# Altium project CONTROLBAORD.PrjPcb
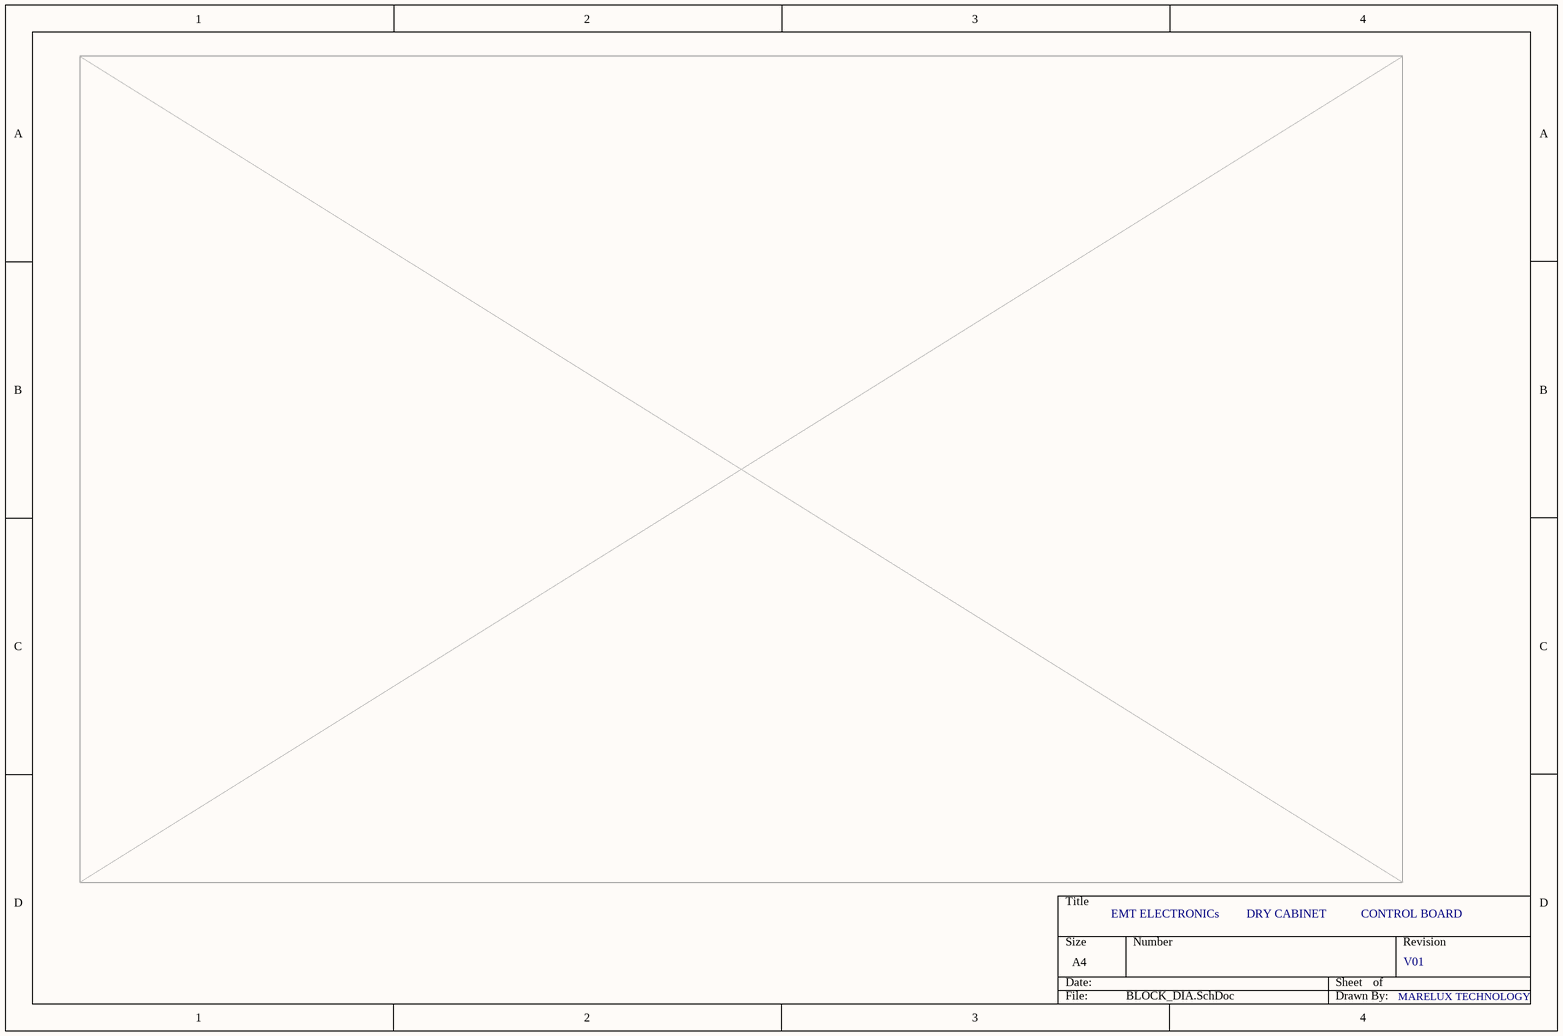
[diagram p0: BLOCK_DIA.SchDoc]
CUSTOMER: EMT ELECTRONICs; DATE(MONTH): JULY; DESIGNER: MARELUX TECHNOLOGY; HARDWARE: CONTROL BOARD; PROJECT: DRY CABINET; VERSION: V01
7 sheets, 152 parts. Net scope: flat (ports and power ports of the same name join across sheets).
Board file: CONTROLBAORD_PCB.PcbDoc
Sheets:
  BLOCK_DIA.SchDoc
  POWER.SchDoc
  MICROCONTROLLER.SchDoc
  UART_USB.SchDoc
  MISC.SchDoc
  ALARM_POWER.SchDoc
  CONNECTORs.SchDoc

## Sheet BLOCK_DIA.SchDoc
size A4

## Sheet POWER.SchDoc
size A4
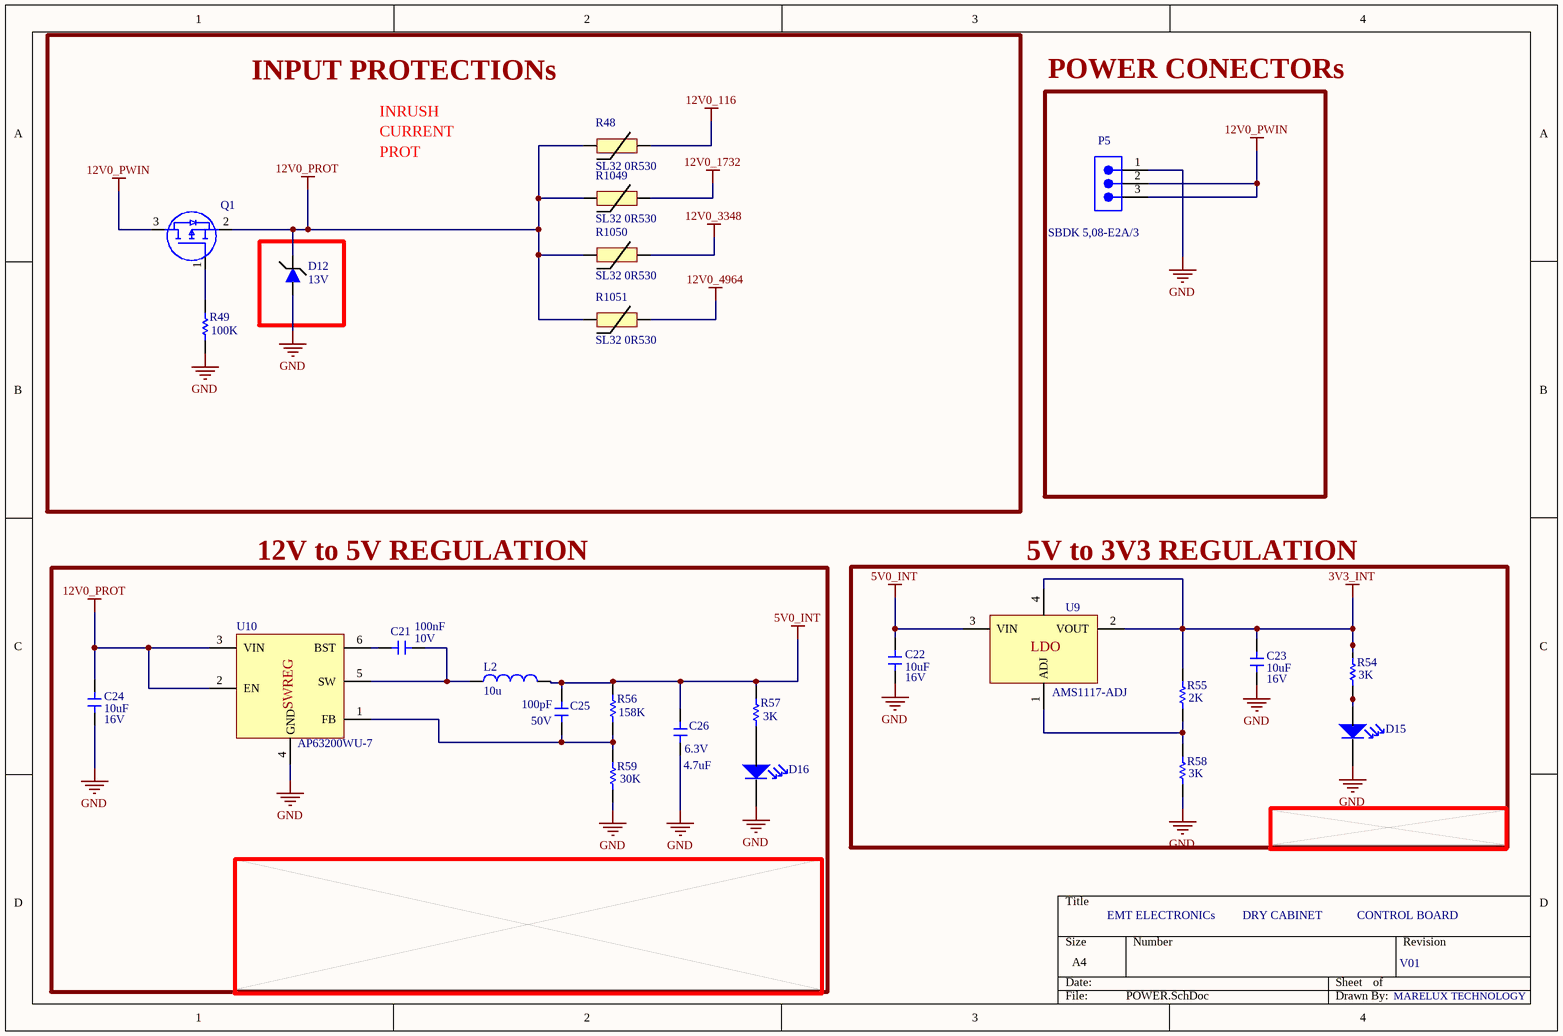
[diagram p1: POWER.SchDoc]

### Parts
C21  value 100nF  Voltage: 10V  [CAP_0402_CER]  (hidden comment: CL05B104KP5NNNC)
C22  value 10uF  Voltage: 16V  [CAP_0805_CER]  (hidden comment: CL21A106KOQNNNE)
C23  value 10uF  Voltage: 16V  [CAP_0805_CER]  (hidden comment: CL21A106KOQNNNE)
C24  value 10uF  Voltage: 16V  [CAP_0805_CER]  (hidden comment: CL21A106KOQNNNE)
C25  value 100pF  Voltage: 50V  [CAP_0402_CER]  (hidden comment: CC0402JRNPO9BN101)
C26  value 4.7uF  Voltage: 6.3V  [CAP_0402_CER]  (hidden comment: CL10A475KP8NNNC)
D12  value 13V  [SOD-123F]  (hidden comment: SMF13A)
D15  HSMM-C170  [LED_0805_SMD]  (value not drawn)
D16  HSMM-C170  [LED_0805_SMD]  (value not drawn)
L2  value 10u  [IND_YAGEO]  (hidden comment: BMRB00060630100MA1)
P5  SBDK 5,08-E2A/3  [691311500003]
Q1  SQM110P06-8M9L_GE3  [SQM110P06_MOSFET]  (value not drawn)
R48  SL32 0R530  [SL32 0R530]
R49  value 100K  [RES_0402_SMD]  (hidden comment: RMCF0402JT100K)
R54  value 3K  [RES_0402_SMD]  (hidden comment: RMCF0402FT3K00)
R55  value 2K  [RES_0402_SMD]  (hidden comment: RMCF0402FT2K00)
R56  value 158K  [RES_0402_SMD]  (hidden comment: RMCF0402FT158K)
R57  value 3K  [RES_0402_SMD]  (hidden comment: RMCF0402FT3K00)
R58  value 3K  [RES_0402_SMD]  (hidden comment: RMCF0402FT3K00)
R59  value 30K  [RES_0402_SMD]  (hidden comment: *)
R1049  SL32 0R530  [SL32 0R530]
R1050  SL32 0R530  [SL32 0R530]
R1051  SL32 0R530  [SL32 0R530]
U9  AMS1117-ADJ  [SOT-223-3]
U10  AP63200WU-7  [TSOT-23-6]

### Blocks framed on the sheet
INPUT PROTECTIONs: D12 Q1 R48 R49 R1049-R1051
POWER CONECTORs: P5
12V to 5V REGULATION: C21 C24-C26 D16 L2 R56 R57 R59 U10
5V to 3V3 REGULATION: C22 C23 D15 R54 R55 R58 U9

### Nets
3V3_INT: C23.2 R54.2 R55.2 U9.2(VOUT) U9.4(OUT)
5V0_INT: C22.2 C25.2 C26.2 L2.2 R56.2 R57.2 U9.3(VIN)
12V0_116: R48.2
12V0_1732: R1049.2
12V0_3348: R1050.2
12V0_4964: R1051.2
12V0_PROT: C24.2 D12.1(C) Q1.2(S) R48.1 R1049.1 R1050.1 R1051.1 U10.2(EN) U10.3(VIN)
12V0_PWIN: P5.2 P5.3 Q1.3(D)
GND: C22.1 C23.1 C24.1 C26.1 D12.2(A) D15.C D16.C P5.1 R49.1 R58.1 R59.1 U10.4(GND)
NetC21_1: C21.1 U10.6(BST)
NetC21_2: C21.2 L2.1 U10.5(SW)
NetC25_1: C25.1 R56.1 R59.2 U10.1(FB)
NetD15_A: D15.A R54.1
NetD16_A: D16.A R57.1
NetQ1_1: Q1.1(G) R49.2
NetR55_1: R55.1 R58.2 U9.1(ADJ)

### Notes on the sheet
- INRUSH
- CURRENT
- PROT
- (in symbol AMS1117-ADJ) LDO
- (in symbol AP63200WU-7) SWREG

### Library data of the parts
C21 C25 C26 = CAP_GEN_CER: Generic; Place: P; Power: *; Package: 0402; Tolerance: *; Operating Temp.: *
  C21: Part Number: CL05B104KP5NNNC
  C25: Part Number: CC0402JRNPO9BN101
  C26: Part Number: CL10A475KP8NNNC
C22-C24 = CAP_GEN_CER: 10uF 0805 Ceramic Capacitor; Place: P; Part Number: CL21A106KOQNNNE; Power: *; Package: *; Tolerance: *; Operating Temp.: *
D12 = SMF13A: TVS DIODE 200W 14.4V-15.9V SOD-123; Manufacturer: ANBON SEMI; Voltage: 14.4V; Place: P; Part Number: SMF13A; Power: 200W; Tolerance: N/A; Package: SOD-123F; Operating Temp.: -55°C ~ 150°C
D15 = LED_GEN: Manufacturer: Broadcom; Voltage: 3.3V; Place: P; Part Number: HSMM-C170; Value: *; Power: *; Tolerance: *; Package: 0805; Operating Temp.: *
D16 = LED_GEN: Manufacturer: Broadcom; Voltage: 3.3V; Place: POP; Part Number: HSMM-C170; Value: *; Power: *; Tolerance: *; Package: 0805; Operating Temp.: *
L2 = BMRB00060630100MA1: FIXED IND 10UH 4A 68 MOHM SMD; Manufacturer: PULSE; Place: POP; Current: 4; Tolerance: ±20%; Part Number: BMRB00060630100MA1; Power: N/A; Package: IND_YAGEO; Operating Temp.: -55°C ~ 125°C
P5 = 691311500003: WR-TBL Series 311 Open Vertical PCB Header, THT, pitch 5.08mm, 03p; Manufacturer: Wurth Elektronik; Modularity: No; Rated Current: 20A; System: Pluggable Connector; Working Voltage: 300V; Manufacturer Part Number: SBDK 5,08-E2A/3; Category: Terminal Block; Match Code: WR-TBL; ComponentLink1Description: Website Link; ComponentLink1URL: https://www.we-online.com/redexpert/article/691311500003?ad; ComponentLink2Description: Datasheet Link; ComponentLink2URL: https://www.we-online.com/redexpert/spec/691311500003?ad; Mount: Through Hole; Min Operating Temperature: -40°C; Max Operating Temperature: 105°C; Packaging: Box; Application: Pluggable; Number of Pins: 3; Number of Rows: 1; Orientation: Vertical; Pitch: 5.08mm
Q1 = SQM110P06-8M9L_GE3: P-Channel 60 V 110A (Tc) 230W (Tc) Surface Mount TO-263 (D2PAK); Voltage: 20 V; Place: POP; Part Number: SQM110P06-8M9L_GE3; Value: N/A; Power: 110A; Tolerance: N/A; Package: SQM110P06-8M9L_GE3; Operating Temp.: -55°C ~ 150°C
R48 R1049-R1051 = SL32 0R530: Inrush Current Limiter 500 mOhms ±20% 30 A 1.220" (31.00mm); Manufacturer: Cantherm; Value: 30A; Tolerance: 20; Place: POP; Part Number: SL32 0R530; Voltage: N/A; Power: N/A; Package: SL32 0R530; Operating Temp.: -65°C ~ 150°C
R49 R54-R59 = RES_GEN_SMD: Generic Chip Res; Place: P; Power: *; Tolerance: *; Voltage: *; Operating Temp.: *
  R49: Package: *; Part Number: RMCF0402JT100K
  R54 R57 R58: Package: *; Part Number: RMCF0402FT3K00
  R55: Package: *; Part Number: RMCF0402FT2K00
  R56: Package: *; Part Number: RMCF0402FT158K
  R59: Package: RMCF0402JT30K0; Part Number: *
U9 = AMS1117-ADJ: IC LDO REG ADJ 1A SOT223; Manufacturer: EVVO; Place: P; Part Number: AMS1117-ADJ; Value: 1A; Voltage: ADJ; Power: N/A; Tolerance: N/A; Package: SOT-223-3; Operating Temp.: -40°C ~ 85°C
U10 = AP63200WU-7: IC REG BUCK ADJ 2A TSOT23-6 / 3.8V to 32V; Manufacturer: Diodes Incorporated; Operatin Temp.: -40°C ~ 85; Place: POP; Part Number: AP63200WU-7; Value: N/A; Voltage: ADJ; Power: N/A; Tolerance: N/A; Package: TSOT-23-6

## Sheet MICROCONTROLLER.SchDoc
size A4 portrait
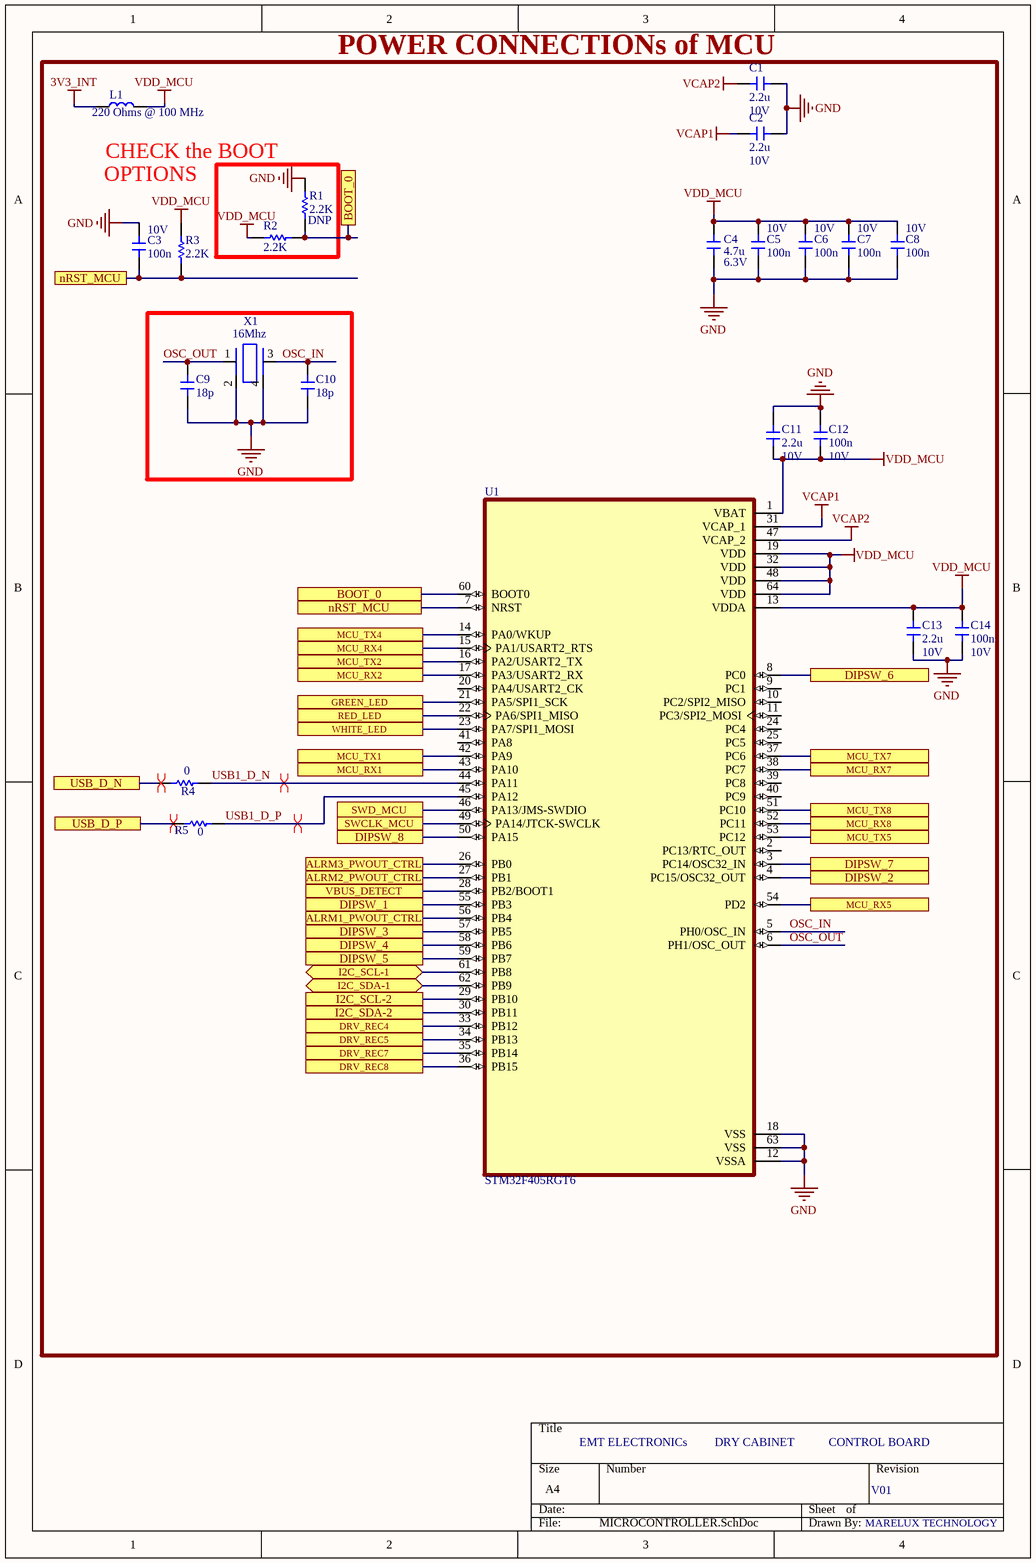
[diagram p2: MICROCONTROLLER.SchDoc]

### Parts
C1  value 2.2u  Voltage: 10V  [CAP_0603_CER]  (hidden comment: CL10A225KP8NNNC)
C2  value 2.2u  Voltage: 10V  [CAP_0603_CER]  (hidden comment: CL10A225KP8NNNC)
C3  value 100n  Voltage: 10V  [CAP_0402_CER]  (hidden comment: CL05B104KP5NNNC)
C4  value 4.7u  Voltage: 6.3V  [CAP_0603_CER]  (hidden comment: CL10A475KP8NNNC)
C5  value 100n  Voltage: 10V  [CAP_0402_CER]  (hidden comment: CL05B104KP5NNNC)
C6  value 100n  Voltage: 10V  [CAP_0402_CER]  (hidden comment: CL05B104KP5NNNC)
C7  value 100n  Voltage: 10V  [CAP_0402_CER]  (hidden comment: CL05B104KP5NNNC)
C8  value 100n  Voltage: 10V  [CAP_0402_CER]  (hidden comment: CL05B104KP5NNNC)
C9  value 18p  [CAP_0402_CER]  (hidden comment: CC0402JRNPO9BN180)
C10  value 18p  [CAP_0402_CER]  (hidden comment: CC0402JRNPO9BN180)
C11  value 2.2u  Voltage: 10V  [CAP_0603_CER]  (hidden comment: CL10A225KP8NNNC)
C12  value 100n  Voltage: 10V  [CAP_0402_CER]  (hidden comment: CL05B104KP5NNNC)
C13  value 2.2u  Voltage: 10V  [CAP_0603_CER]  (hidden comment: CL10A225KP8NNNC)
C14  value 100n  Voltage: 10V  [CAP_0402_CER]  (hidden comment: CL05B104KP5NNNC)
L1  value 220 Ohms @ 100 MHz  [IND_0603_SMD]  (hidden comment: MPZ1608S221ATA00)
R1  value 2.2K  Place: DNP  [RES_0402_SMD]  (hidden comment: RMCF0402JT2K20)
R2  value 2.2K  [RES_0402_SMD]  (hidden comment: RMCF0402JT2K20)
R3  value 2.2K  [RES_0402_SMD]  (hidden comment: RMCF0402JT2K20)
R4  value 0  [RES_0402_SMD]  (hidden comment: RC0402JR-070RL)
R5  value 0  [RES_0402_SMD]  (hidden comment: RC0402JR-070RL)
U1  STM32F405RGT6  [LQFP64-10x10mm]
X1  value 16Mhz  [XTAL-4SMD]  (hidden comment: CF4016M00009T1521005)

### Ports
ALRM1_PWOUT_CTRL, ALRM2_PWOUT_CTRL, ALRM3_PWOUT_CTRL, BOOT_0, DIPSW_1, DIPSW_2, DIPSW_3, DIPSW_4, DIPSW_5, DIPSW_6, DIPSW_7, DIPSW_8, DRV_REC4, DRV_REC5, DRV_REC7, DRV_REC8, GREEN_LED, I2C_SCL-1 (bidir), I2C_SCL-2, I2C_SDA-1 (bidir), I2C_SDA-2, MCU_RX1, MCU_RX2, MCU_RX4, MCU_RX5, MCU_RX7, MCU_RX8, MCU_TX1, MCU_TX2, MCU_TX4, MCU_TX5, MCU_TX7, MCU_TX8, nRST_MCU, RED_LED, SWCLK_MCU, SWD_MCU, USB_D_N, USB_D_P, VBUS_DETECT, WHITE_LED

### Nets
3V3_INT: L1.1
GND: C1.1 C2.1 C3.1 C4.1 C5.2 C6.2 C7.2 C8.2 C9.2 C10.2 C11.2 C12.1 C13.1 C14.2 R1.2 U1.12(VSSA) U1.18(VSS) U1.63(VSS) X1.2 X1.4
VCAP1: C2.2 U1.31(VCAP_1)
VCAP2: C1.2 U1.47(VCAP_2)
VDD_MCU: C4.2 C5.1 C6.1 C7.1 C8.1 C11.1 C12.2 C13.2 C14.1 L1.2 R2.2 R3.1 U1.1(VBAT) U1.13(VDDA) U1.19(VDD) U1.32(VDD) U1.48(VDD) U1.64(VDD)
I2C_SCL-1: U1.61(PB8) ; port I2C_SCL-1
I2C_SDA-1: U1.62(PB9) ; port I2C_SDA-1
OSC_IN: C10.1 U1.5(PH0/OSC_IN) X1.3
OSC_OUT: C9.1 U1.6(PH1/OSC_OUT) X1.1
USB1_D_N: R4.2 U1.44(PA11)
USB1_D_P: R5.2 U1.45(PA12)
USB_D_N: R4.1 ; port USB_D_N
USB_D_P: R5.1 ; port USB_D_P
NetC3_2: C3.2 R3.2 U1.7(NRST) ; port nRST_MCU
NetEXTRA1_1: U1.29(PB10) ; port I2C_SCL-2
NetEXTRA1_2: U1.30(PB11) ; port I2C_SDA-2
NetEXTRA1_4: U1.17(PA3/USART2_RX) ; port MCU_RX2
NetEXTRA1_5: U1.16(PA2/USART2_TX) ; port MCU_TX2
NetPROG1_2: U1.49(PA14/JTCK-SWCLK) ; port SWCLK_MCU
NetPROG1_3: U1.46(PA13/JMS-SWDIO) ; port SWD_MCU
NetQ6_1: U1.56(PB4) ; port ALRM1_PWOUT_CTRL
NetQ2001_1: U1.27(PB1) ; port ALRM2_PWOUT_CTRL
NetQ2004_1: U1.26(PB0) ; port ALRM3_PWOUT_CTRL
NetR1_1: R1.1 R2.1 U1.60(BOOT0) ; port BOOT_0
NetR8_1: U1.50(PA15) ; port DIPSW_8
NetR9_1: U1.3(PC14/OSC32_IN) ; port DIPSW_7
NetR10_1: U1.8(PC0) ; port DIPSW_6
NetR11_1: U1.59(PB7) ; port DIPSW_5
NetR12_1: U1.58(PB6) ; port DIPSW_4
NetR13_1: U1.57(PB5) ; port DIPSW_3
NetR14_1: U1.4(PC15/OSC32_OUT) ; port DIPSW_2
NetR15_1: U1.55(PB3) ; port DIPSW_1
NetR23_2: U1.15(PA1/USART2_RTS) ; port MCU_RX4
NetR24_2: U1.54(PD2) ; port MCU_RX5
NetR27_2: U1.14(PA0/WKUP) ; port MCU_TX4
NetR28_2: U1.53(PC12) ; port MCU_TX5
NetR31_2: U1.33(PB12) ; port DRV_REC4
NetR32_2: U1.34(PB13) ; port DRV_REC5
NetR33_2: U1.22(PA6/SPI1_MISO) ; port RED_LED
NetR36_2: U1.38(PC7) ; port MCU_RX7
NetR37_2: U1.52(PC11) ; port MCU_RX8
NetR38_2: U1.23(PA7/SPI1_MOSI) ; port WHITE_LED
NetR41_2: U1.37(PC6) ; port MCU_TX7
NetR42_2: U1.51(PC10) ; port MCU_TX8
NetR45_2: U1.35(PB14) ; port DRV_REC7
NetR46_2: U1.36(PB15) ; port DRV_REC8
NetR47_2: U1.21(PA5/SPI1_SCK) ; port GREEN_LED
NetR61_2: U1.28(PB2/BOOT1) ; port VBUS_DETECT
NetU1_42: U1.42(PA9) ; port MCU_TX1
NetU1_43: U1.43(PA10) ; port MCU_RX1

Not connected (* = marked no-connect by the designer): U1 2(PC13/RTC_OUT) 9(PC1) 10(PC2/SPI2_MISO) 11(PC3/SPI2_MOSI) 20(PA4/USART2_CK) 24(PC4) 25(PC5) 39(PC8) 40(PC9) 41(PA8)

### Layout directives
differential pair: USB1_D_N, USB1_D_P, USB_D_N, USB_D_P

### Notes on the sheet
- POWER CONNECTIONs of MCU
- CHECK the BOOT
- OPTIONS

### Library data of the parts
C1-C14 = CAP_GEN_CER: Generic; Place: P; Power: *; Tolerance: *; Operating Temp.: *
  C1 C2 C11 C13: Part Number: CL10A225KP8NNNC; Package: *
  C3 C5-C8 C12 C14: Part Number: CL05B104KP5NNNC; Package: *
  C4: Part Number: CL10A475KP8NNNC; Package: *
  C9 C10: Part Number: CC0402JRNPO9BN180; Package: 0402; Voltage: *
L1 = IND_GEN_SMD: Generic SMD IND/BEAD; Place: P; Part Number: MPZ1608S221ATA00; Power: *; Package: *; Tolerance: *; Voltage: *; Operating Temp.: *
R1 = RES_GEN_SMD: Generic Chip Res; Package: *; Part Number: RMCF0402JT2K20; Power: *; Tolerance: *; Voltage: *; Operating Temp.: *
R2-R5 = RES_GEN_SMD: Generic Chip Res; Place: P; Package: *; Power: *; Tolerance: *; Voltage: *; Operating Temp.: *
  R2 R3: Part Number: RMCF0402JT2K20
  R4 R5: Part Number: RC0402JR-070RL
U1 = STM32F405RGT6: High-performance foundation line, ARM Cortex-M4 core with DSP and FPU, 1 Mbyte Flash, 168 MHz CPU, ART Accelerator; Value: *; Package: None; MP: STM32F405RGT6; Price: None; Availability: Unavailable
X1 = XTAL-4PINs: 16 MHz ±10ppm Crystal 9pF 40 Ohms 4-SMD, No Lead; Manufacturer: Hefei Jingweite Electronics Co., Ltd.; Place: POP; Voltage: N/A; Tolerance: ±10ppm; Power: N/A; Part Number: CF4016M00009T1521005; Operating Temp.: -40°C ~ 125°C

## Sheet UART_USB.SchDoc
size A4
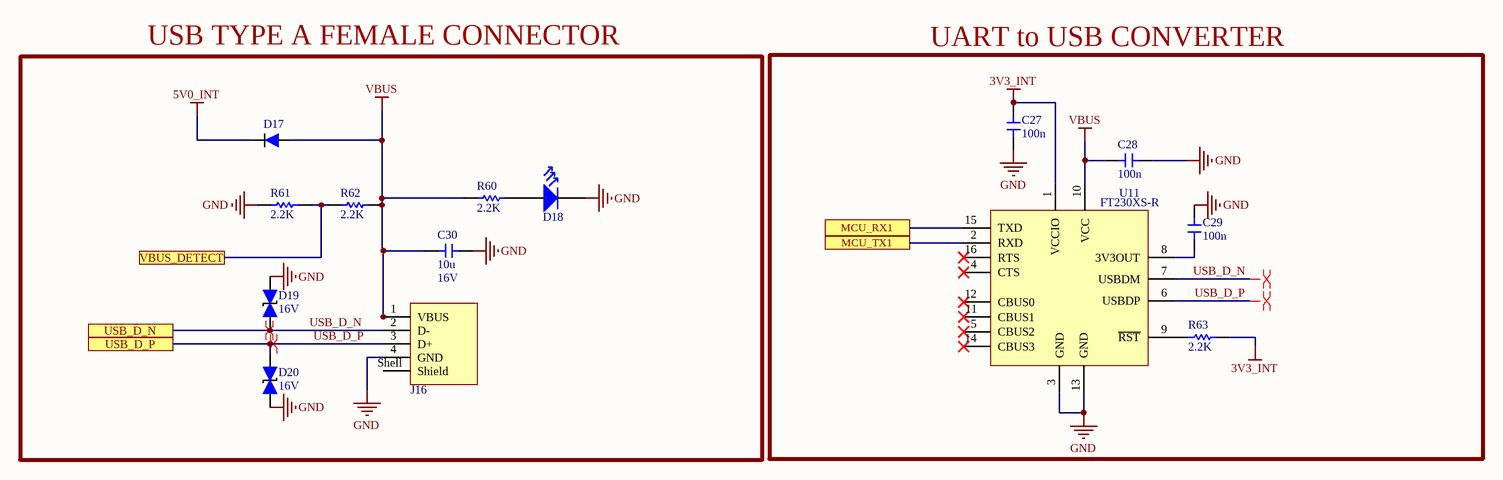
[diagram p3: UART_USB.SchDoc]

### Parts
C27  value 100n  [CAP_0402_CER]  (hidden comment: CL05B104KP5NNNC)
C28  value 100n  [CAP_0402_CER]  (hidden comment: CL05B104KP5NNNC)
C29  value 100n  [CAP_0402_CER]  (hidden comment: CL05B104KP5NNNC)
C30  value 10u  Voltage: 16V  [CAP_0805_CER]  (hidden comment: CL21A106KOQNNNE)
D17  BAT42WS-E3-08  [SOD323F]  (value not drawn)
D18  *  [LED_0805_SMD]  (value not drawn)
D19  value 16V  [SOD-123F]  (hidden comment: SMF16CA)
D20  value 16V  [SOD-123F]  (hidden comment: SMF16CA)
J16  UJ2-BH-1-TH  [61400416021]  (value not drawn)
R60  value 2.2K  [RES_0402_SMD]  (hidden comment: RMCF0402JT2K20)
R61  value 2.2K  [RES_0402_SMD]  (hidden comment: RMCF0402JT2K20)
R62  value 2.2K  [RES_0402_SMD]  (hidden comment: RMCF0402JT2K20)
R63  value 2.2K  [RES_0402_SMD]  (hidden comment: RMCF0402JT2K20)
U11  FT230XS-R  [16-SSOP]

### Blocks framed on the sheet
USB TYPE A FEMALE CONNECTOR: C30 D17-D20 J16 R60-R62
UART to USB CONVERTER: C27-C29 R63 U11

### Ports
MCU_RX1, MCU_TX1, USB_D_N, USB_D_P, VBUS_DETECT

### Nets
3V3_INT: C27.1 R63.2 U11.1(VCCIO)
5V0_INT: D17.1(C)
GND: C27.2 C28.1 C29.1 C30.1 D18.C D19.1(C) D20.2(A) J16.4(GND) R61.1 U11.3(GND) U11.13(GND)
VBUS: C28.2 C30.2 D17.2(A) J16.1(VBUS) R60.1 R62.2 U11.10(VCC)
USB_D_N: D19.2(A) J16.2(D-) U11.7(USBDM) ; port USB_D_N
USB_D_P: D20.1(C) J16.3(D+) U11.6(USBDP) ; port USB_D_P
NetC29_2: C29.2 U11.8(3V3OUT)
NetD18_A: D18.A R60.2
NetR61_2: R61.2 R62.1 ; port VBUS_DETECT
NetR63_1: R63.1 U11.9(~{RST})
NetU1_42: U11.2(RXD) ; port MCU_TX1
NetU1_43: U11.15(TXD) ; port MCU_RX1

Not connected (* = marked no-connect by the designer): J16 Shell(Shield); U11 4(CTS)* 5(CBUS2)* 11(CBUS1)* 12(CBUS0)* 14(CBUS3)* 16(RTS)*

### Layout directives
differential pair: USB_D_N, USB_D_P

### Library data of the parts
C27-C29 = CAP_GEN_CER: Generic; Voltage: 10V; Place: P; Part Number: CL05B104KP5NNNC; Power: *; Package: *; Tolerance: *; Operating Temp.: *
C30 = CAP_GEN_CER: Generic; Place: P; Part Number: CL21A106KOQNNNE; Power: *; Package: *; Tolerance: *; Operating Temp.: *
D17 = BAT42WS-E3-08: DIODE SCHOTTKY 30V 200MA; Place: POP; Part Number: BAT42WS-E3-08; Value: 200mA; Voltage: 30V; Power: N/A; Tolerance: N/A; Package: SC-76; Operating Temp.: -55°C ~ 125°C
D18 = LED_GEN: Place: P/DNP; Part Number: *; Value: *; Voltage: *; Power: *; Tolerance: *; Package: *; Operating Temp.: *
D19 D20 = SMF16CA: Unidirectional TVS DIODE 200W 16V-17.8V SOD-123; Manufacturer: ANBON SEMI; Voltage: 17.8V; Place: POP; Part Number: SMF16CA; Power: 200W; Tolerance: N/A; Package: SOD-123F; Operating Temp.: -55°C ~ 150°C
J16 = 61400416021: WR-COM USB 2.0 Type A Horizontal; Manufacturer: Wurth Elektronik; Match Code: WR-USB; Gender: Receptacle; Interface Type: Type A; Number of Ports: 1; Rated Current: 1.5A; Working Voltage: 30V (AC); Manufacturer Part Number: 61400416021; Category: Input/Output Connectors; ComponentLink1Description: Website Link; ComponentLink1URL: https://www.we-online.com/redexpert/article/61400416021?ad; ComponentLink2Description: Datasheet Link; ComponentLink2URL: https://www.we-online.com/redexpert/spec/61400416021?ad; Mount: Through Hole; Operating Temperature Max: 105°C; Operating Temperature Min: -40°C; Packaging: Tray; Application: USB 2.0; Number of Pins: 4; Orientation: Horizontal
R60-R63 = RES_GEN_SMD: Generic Chip Res; Place: P; Package: *; Part Number: RMCF0402JT2K20; Power: *; Tolerance: *; Voltage: *; Operating Temp.: *
U11 = FT230XS-R: IC USB SERIAL BASIC UART 16SSOP; Operatig Temp.: -40°C ~ 85°C; Place: POP; Part Number: FT230XS-R; Value: N/A; Voltage: N/A; Power: N/A; Tolerance: N/A; Package: 16-SSOP

## Sheet MISC.SchDoc
size A3
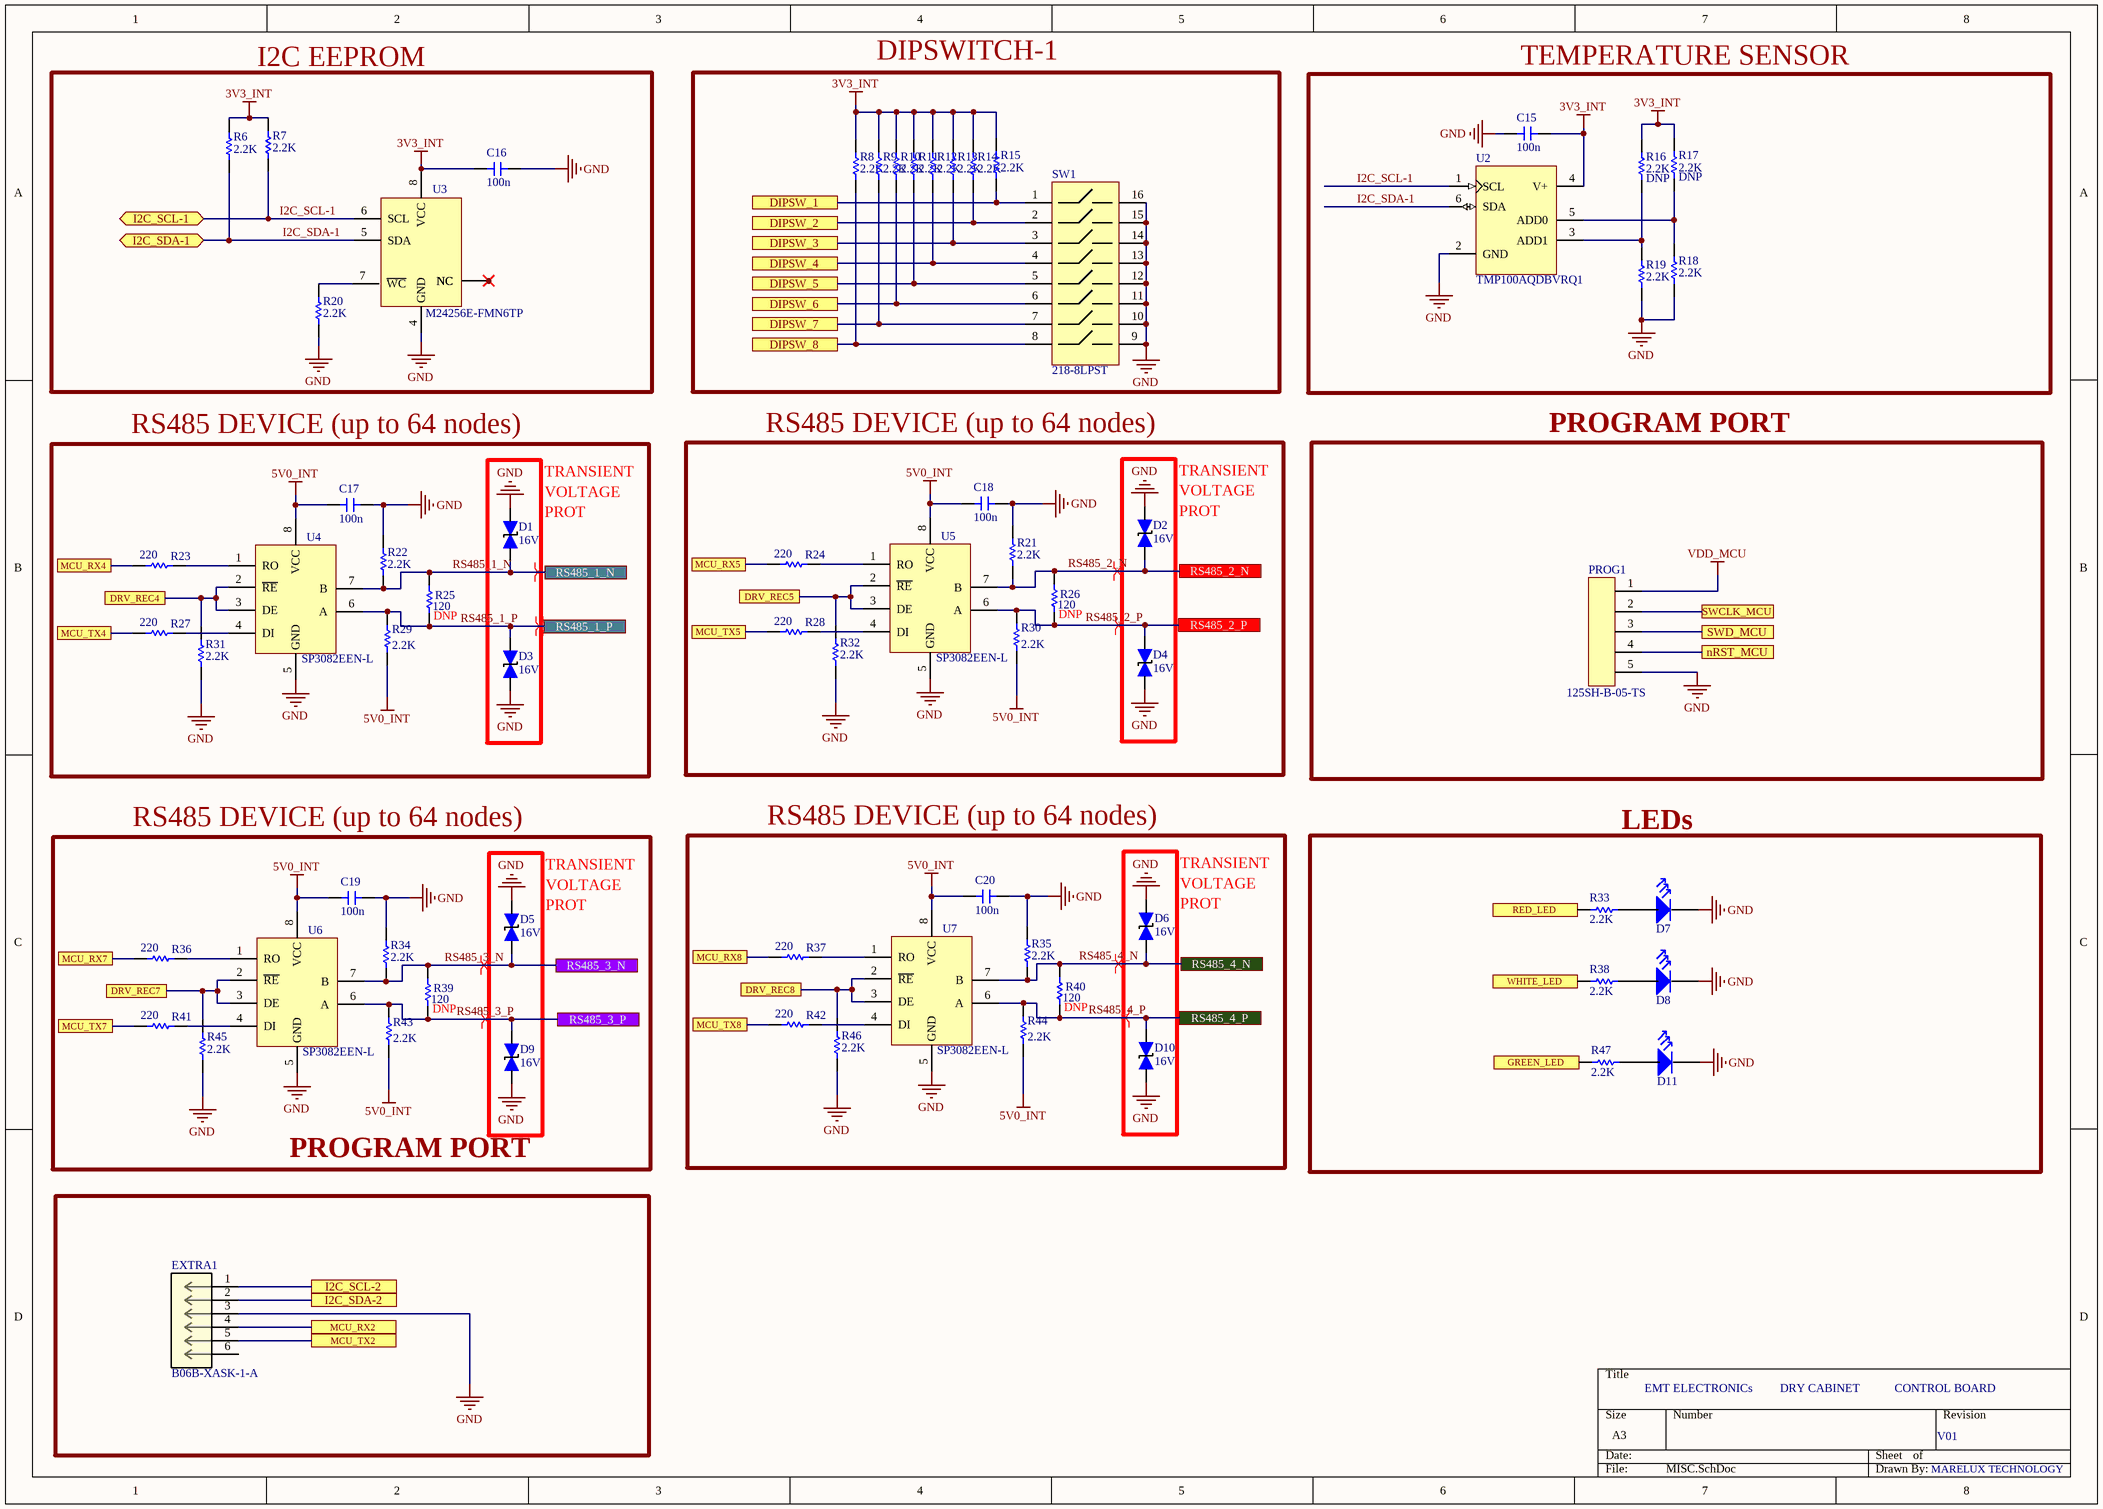
[diagram p4: MISC.SchDoc]

### Parts
C15  value 100n  [CAP_0402_CER]  (hidden comment: CL05B104KP5NNNC)
C16  value 100n  [CAP_0402_CER]  (hidden comment: CL05B104KP5NNNC)
C17  value 100n  [CAP_0402_CER]  (hidden comment: CL05B104KP5NNNC)
C18  value 100n  [CAP_0402_CER]  (hidden comment: CL05B104KP5NNNC)
C19  value 100n  [CAP_0402_CER]  (hidden comment: CL05B104KP5NNNC)
C20  value 100n  [CAP_0402_CER]  (hidden comment: CL05B104KP5NNNC)
D1  value 16V  [SOD-123F]  (hidden comment: SMF16CA)
D2  value 16V  [SOD-123F]  (hidden comment: SMF16CA)
D3  value 16V  [SOD-123F]  (hidden comment: SMF16CA)
D4  value 16V  [SOD-123F]  (hidden comment: SMF16CA)
D5  value 16V  [SOD-123F]  (hidden comment: SMF16CA)
D6  value 16V  [SOD-123F]  (hidden comment: SMF16CA)
D7  *  [LED_0805_SMD]  (value not drawn)
D8  *  [LED_0805_SMD]  (value not drawn)
D9  value 16V  [SOD-123F]  (hidden comment: SMF16CA)
D10  value 16V  [SOD-123F]  (hidden comment: SMF16CA)
D11  *  [LED_0805_SMD]  (value not drawn)
EXTRA1  B06B-XASK-1-A  [conn6_2132415-6_TEC]
PROG1  125SH-B-05-TS  [1.25_ST_5POS_THT]
R6  value 2.2K  [RES_0402_SMD]  (hidden comment: RMCF0402JT2K20)
R7  value 2.2K  [RES_0402_SMD]  (hidden comment: RMCF0402JT2K20)
R8  value 2.2K  [RES_0402_SMD]  (hidden comment: RMCF0402JT2K20)
R9  value 2.2K  [RES_0402_SMD]  (hidden comment: RMCF0402JT2K20)
R10  value 2.2K  [RES_0402_SMD]  (hidden comment: RMCF0402JT2K20)
R11  value 2.2K  [RES_0402_SMD]  (hidden comment: RMCF0402JT2K20)
R12  value 2.2K  [RES_0402_SMD]  (hidden comment: RMCF0402JT2K20)
R13  value 2.2K  [RES_0402_SMD]  (hidden comment: RMCF0402JT2K20)
R14  value 2.2K  [RES_0402_SMD]  (hidden comment: RMCF0402JT2K20)
R15  value 2.2K  [RES_0402_SMD]  (hidden comment: RMCF0402JT2K20)
R16  value 2.2K  Place: DNP  [RES_0402_SMD]  (hidden comment: RMCF0402JT2K20)
R17  value 2.2K  Place: DNP  [RES_0402_SMD]  (hidden comment: RMCF0402JT2K20)
R18  value 2.2K  [RES_0402_SMD]  (hidden comment: RMCF0402JT2K20)
R19  value 2.2K  [RES_0402_SMD]  (hidden comment: RMCF0402JT2K20)
R20  value 2.2K  [RES_0402_SMD]  (hidden comment: RMCF0402JT2K20)
R21  value 2.2K  [RES_0402_SMD]  (hidden comment: RMCF0402JT2K20)
R22  value 2.2K  [RES_0402_SMD]  (hidden comment: RMCF0402JT2K20)
R23  value 220  [RES_0402_SMD]  (hidden comment: RMCF0402JT220R)
R24  value 220  [RES_0402_SMD]  (hidden comment: RMCF0402JT220R)
R25  value 120  Place: DNP  [RES_0805_SMD]  (hidden comment: ESR10EZPJ121)
R26  value 120  Place: DNP  [RES_0805_SMD]  (hidden comment: ESR10EZPJ121)
R27  value 220  [RES_0402_SMD]  (hidden comment: RMCF0402JT220R)
R28  value 220  [RES_0402_SMD]  (hidden comment: RMCF0402JT220R)
R29  value 2.2K  [RES_0402_SMD]  (hidden comment: RMCF0402JT2K20)
R30  value 2.2K  [RES_0402_SMD]  (hidden comment: RMCF0402JT2K20)
R31  value 2.2K  [RES_0402_SMD]  (hidden comment: RMCF0402JT2K20)
R32  value 2.2K  [RES_0402_SMD]  (hidden comment: RMCF0402JT2K20)
R33  value 2.2K  [RES_0402_SMD]  (hidden comment: RMCF0402JT2K20)
R34  value 2.2K  [RES_0402_SMD]  (hidden comment: RMCF0402JT2K20)
R35  value 2.2K  [RES_0402_SMD]  (hidden comment: RMCF0402JT2K20)
R36  value 220  [RES_0402_SMD]  (hidden comment: RMCF0402JT220R)
R37  value 220  [RES_0402_SMD]  (hidden comment: RMCF0402JT220R)
R38  value 2.2K  [RES_0402_SMD]  (hidden comment: RMCF0402JT2K20)
R39  value 120  Place: DNP  [RES_0805_SMD]  (hidden comment: ESR10EZPJ121)
R40  value 120  Place: DNP  [RES_0805_SMD]  (hidden comment: ESR10EZPJ121)
R41  value 220  [RES_0402_SMD]  (hidden comment: RMCF0402JT220R)
R42  value 220  [RES_0402_SMD]  (hidden comment: RMCF0402JT220R)
R43  value 2.2K  [RES_0402_SMD]  (hidden comment: RMCF0402JT2K20)
R44  value 2.2K  [RES_0402_SMD]  (hidden comment: RMCF0402JT2K20)
R45  value 2.2K  [RES_0402_SMD]  (hidden comment: RMCF0402JT2K20)
R46  value 2.2K  [RES_0402_SMD]  (hidden comment: RMCF0402JT2K20)
R47  value 2.2K  [RES_0402_SMD]  (hidden comment: RMCF0402JT2K20)
SW1  218-8LPST  [218-8LPST]
U2  TMP100AQDBVRQ1  [TSOT-23-6]
U3  M24256E-FMN6TP  [8-SOIC(0.154", 3.90mm Width)]
U4  SP3082EEN-L  [8-SOIC(0.154", 3.90mm Width)]
U5  SP3082EEN-L  [8-SOIC(0.154", 3.90mm Width)]
U6  SP3082EEN-L  [8-SOIC(0.154", 3.90mm Width)]
U7  SP3082EEN-L  [8-SOIC(0.154", 3.90mm Width)]

### Blocks framed on the sheet
I2C EEPROM: C16 R6 R7 R20 U3
DIPSWITCH-1: R8-R15 SW1
TEMPERATURE SENSOR: C15 R16-R19 U2
RS485 DEVICE (up to 64 nodes): C17 D1 D3 R22 R23 R25 R27 R29 R31 U4
RS485 DEVICE (up to 64 nodes): C18 D2 D4 R21 R24 R26 R28 R30 R32 U5
PROGRAM PORT: PROG1
RS485 DEVICE (up to 64 nodes): C20 D6 D10 R35 R37 R40 R42 R44 R46 U7
LEDs: D7 D8 D11 R33 R38 R47

### Ports
DIPSW_1, DIPSW_2, DIPSW_3, DIPSW_4, DIPSW_5, DIPSW_6, DIPSW_7, DIPSW_8, DRV_REC4, DRV_REC5, DRV_REC7, DRV_REC8, GREEN_LED, I2C_SCL-1 (bidir), I2C_SCL-2, I2C_SDA-1 (bidir), I2C_SDA-2, MCU_RX2, MCU_RX4, MCU_RX5, MCU_RX7, MCU_RX8, MCU_TX2, MCU_TX4, MCU_TX5, MCU_TX7, MCU_TX8, nRST_MCU, RED_LED, RS485_1_N, RS485_1_P, RS485_2_N, RS485_2_P, RS485_3_N, RS485_3_P, RS485_4_N, RS485_4_P, SWCLK_MCU, SWD_MCU, WHITE_LED

### Nets
3V3_INT: C15.1 C16.2 R6.2 R7.2 R8.2 R9.2 R10.2 R11.2 R12.2 R13.2 R14.2 R15.2 R16.2 R17.2 U2.4(V+) U3.8(VCC)
5V0_INT: C17.2 C18.2 C19.2 C20.2 R29.1 R30.1 R43.1 R44.1 U4.8(VCC) U5.8(VCC) U6.8(VCC) U7.8(VCC)
GND: C15.2 C16.1 C17.1 C18.1 C19.1 C20.1 D1.2(A) D2.2(A) D3.2(A) D4.2(A) D5.2(A) D6.2(A) D7.C D8.C D9.2(A) D10.2(A) D11.C EXTRA1.3 PROG1.5 R18.1 R19.1 R20.1 R21.2 R22.2 R31.1 R32.1 R34.2 R35.2 R45.1 R46.1 SW1.9 SW1.10 SW1.11 SW1.12 SW1.13 SW1.14 SW1.15 SW1.16 U2.2(GND) U3.4(GND) U4.5(GND) U5.5(GND) U6.5(GND) U7.5(GND)
VDD_MCU: PROG1.1
I2C_SCL-1: R7.1 U2.1(SCL) U3.6(SCL) ; port I2C_SCL-1
I2C_SDA-1: R6.1 U2.6(SDA) U3.5(SDA) ; port I2C_SDA-1
RS485_1_N: D1.1(C) R22.1 R25.1 U4.7(B) ; port RS485_1_N
RS485_1_P: D3.1(C) R25.2 R29.2 U4.6(A) ; port RS485_1_P
RS485_2_N: D2.1(C) R21.1 R26.1 U5.7(B) ; port RS485_2_N
RS485_2_P: D4.1(C) R26.2 R30.2 U5.6(A) ; port RS485_2_P
RS485_3_N: D5.1(C) R34.1 R39.1 U6.7(B) ; port RS485_3_N
RS485_3_P: D9.1(C) R39.2 R43.2 U6.6(A) ; port RS485_3_P
RS485_4_N: D6.1(C) R35.1 R40.1 U7.7(B) ; port RS485_4_N
RS485_4_P: D10.1(C) R40.2 R44.2 U7.6(A) ; port RS485_4_P
NetC3_2: PROG1.4 ; port nRST_MCU
NetD7_A: D7.A R33.1
NetD8_A: D8.A R38.1
NetD11_A: D11.A R47.1
NetEXTRA1_1: EXTRA1.1 ; port I2C_SCL-2
NetEXTRA1_2: EXTRA1.2 ; port I2C_SDA-2
NetEXTRA1_4: EXTRA1.4 ; port MCU_RX2
NetEXTRA1_5: EXTRA1.5 ; port MCU_TX2
NetPROG1_2: PROG1.2 ; port SWCLK_MCU
NetPROG1_3: PROG1.3 ; port SWD_MCU
NetR8_1: R8.1 SW1.8 ; port DIPSW_8
NetR9_1: R9.1 SW1.7 ; port DIPSW_7
NetR10_1: R10.1 SW1.6 ; port DIPSW_6
NetR11_1: R11.1 SW1.5 ; port DIPSW_5
NetR12_1: R12.1 SW1.4 ; port DIPSW_4
NetR13_1: R13.1 SW1.3 ; port DIPSW_3
NetR14_1: R14.1 SW1.2 ; port DIPSW_2
NetR15_1: R15.1 SW1.1 ; port DIPSW_1
NetR16_1: R16.1 R19.2 U2.3(ADD1)
NetR17_1: R17.1 R18.2 U2.5(ADD0)
NetR20_2: R20.2 U3.7(~{WC})
NetR23_1: R23.1 U4.1(RO)
NetR23_2: R23.2 ; port MCU_RX4
NetR24_1: R24.1 U5.1(RO)
NetR24_2: R24.2 ; port MCU_RX5
NetR27_1: R27.1 U4.4(DI)
NetR27_2: R27.2 ; port MCU_TX4
NetR28_1: R28.1 U5.4(DI)
NetR28_2: R28.2 ; port MCU_TX5
NetR31_2: R31.2 U4.2(~{RE}) U4.3(DE) ; port DRV_REC4
NetR32_2: R32.2 U5.2(~{RE}) U5.3(DE) ; port DRV_REC5
NetR33_2: R33.2 ; port RED_LED
NetR36_1: R36.1 U6.1(RO)
NetR36_2: R36.2 ; port MCU_RX7
NetR37_1: R37.1 U7.1(RO)
NetR37_2: R37.2 ; port MCU_RX8
NetR38_2: R38.2 ; port WHITE_LED
NetR41_1: R41.1 U6.4(DI)
NetR41_2: R41.2 ; port MCU_TX7
NetR42_1: R42.1 U7.4(DI)
NetR42_2: R42.2 ; port MCU_TX8
NetR45_2: R45.2 U6.2(~{RE}) U6.3(DE) ; port DRV_REC7
NetR46_2: R46.2 U7.2(~{RE}) U7.3(DE) ; port DRV_REC8
NetR47_2: R47.2 ; port GREEN_LED
NetU3_1: U3.1(NC) U3.2(NC) U3.3(NC)

Not connected (* = marked no-connect by the designer): EXTRA1 6

### Layout directives
differential pair: RS485_1_N, RS485_1_P, RS485_2_N, RS485_2_P, RS485_3_N, RS485_3_P, RS485_4_N, RS485_4_P

### Notes on the sheet
- (near D1) TRANSIENT
- (near D1) VOLTAGE
- (near D1) PROT
- (near D2) TRANSIENT
- (near D2) VOLTAGE
- (near D2) PROT
- RS485 DEVICE (up to 64 nodes)
- (near D5) TRANSIENT
- (near D5) VOLTAGE
- (near D5) PROT
- (near D6) TRANSIENT
- (near D6) VOLTAGE
- (near D6) PROT
- PROGRAM PORT

### Library data of the parts
C15-C20 = CAP_GEN_CER: Generic; Voltage: 10V; Place: P; Part Number: CL05B104KP5NNNC; Power: *; Package: *; Tolerance: *; Operating Temp.: *
D1-D6 D9 D10 = SMF16CA: as D19 on sheet UART_USB; Part Number: SMF16CA; Power: 200W; Tolerance: N/A; Package: SOD-123F; Operating Temp.: -55°C ~ 150°C
D7 = LED_GEN: Place: P; Part Number: *; Value: *; Voltage: *; Power: *; Tolerance: *; Package: *; Operating Temp.: *
D8 D11 = LED_GEN: Place: P/DNP; Part Number: *; Value: *; Voltage: *; Power: *; Tolerance: *; Package: *; Operating Temp.: *
EXTRA1 = 2132415-6: No Description Available; Mfr_Name: TE Connectivity; TYPE: Header; RefDes: RefDes
PROG1 = 125SH-B-05-TS: CONN HEADER VERT 5POS 1.25MM; Manufacturer: ADAMTECH; Value: 5POS-1.25mm; Place: DNP; Part Number: 125SH-B-05-TS; Voltage: N/A; Power: N/A; Tolerance: N/A; Package: 1.25; Operating Temp.: N/A
R6-R15 R18-R24 R27-R38 R41-R47 = RES_GEN_SMD: Generic Chip Res; Place: P; Package: *; Power: *; Tolerance: *; Voltage: *; Operating Temp.: *
  R6-R15 R18-R22 R29-R35 R38 R43-R47: Part Number: RMCF0402JT2K20
  R23 R24 R27 R28 R36 R37 R41 R42: Part Number: RMCF0402JT220R
R16 R17 R25 R26 R39 R40 = RES_GEN_SMD: Generic Chip Res; Package: *; Power: *; Tolerance: *; Voltage: *; Operating Temp.: *
  R16 R17: Part Number: RMCF0402JT2K20
  R25 R26 R39 R40: Part Number: ESR10EZPJ121
SW1 = 218-8LPST: Dip Switch SPST 8 Position Surface Mount Slide (Standard) Actuator 100mA 20VDC; Manufacturer: CST; Value: SPST-8POS; Place: POP; Tolerance: N/A; Voltage: N/A; Power: N/A; Part Number: 218-8LPST; Package: 218-8LPST; Operating Temp.: -40°C ~ 85°C
U2 = TMP100AQDBVRQ1: Temperature Sensor Digital; Value: -55°C ~ 125°C; Voltage: 2.7V ~ 5.5V; Tolerance: ±2°C; Place: POP; Part Number: TMP100AQDBVRQ1; Power: N/A; Package: SOT-23-6; Operating Temp.: -55°C ~ 125°C
U3 = M24256E-FMN6TP: IC EEPROM 256KBIT I2C 1MHZ 8SO; Manufacturer: STM; Voltage: 1.6V ~ 5.5V; Place: POP; Part Number: M24256E-FMN6TP; Value: 256Kbit; Power: N/A; Tolerance: N/A; Package: 8-SOIC; Operating Temp.: -40°C ~ 85°C
U4-U7 = SP3082EEN-L: 1/1 Transceiver Half RS422, RS485 8-SOIC; Manufacturer: MaxLinear, Inc.; Value: 256nodes; Voltage: 4.5V ~ 5.5V; Place: POP; Part Number: SP3082EEN-L; Power: N/A; Tolerance: N/A; Package: 8-SOIC; Operating Temp.: -40°C ~ 85°C

## Sheet ALARM_POWER.SchDoc
size A4
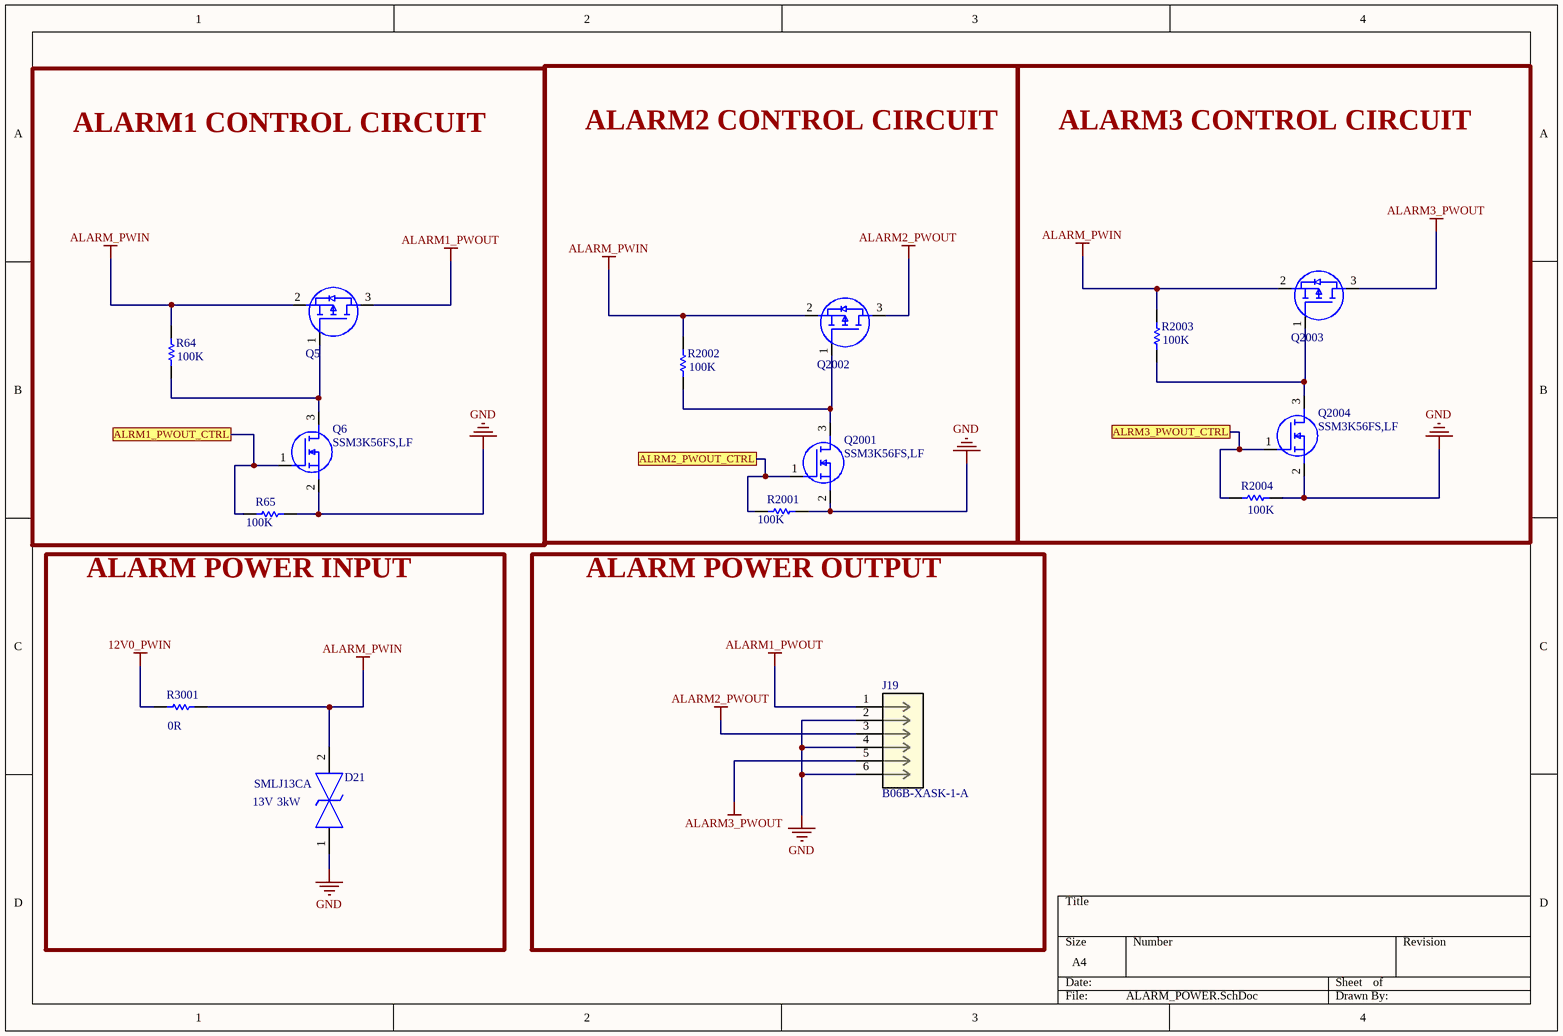
[diagram p5: ALARM_POWER.SchDoc]

### Parts
D21  SMLJ13CA  value 3kW  Voltage: 13V  [DO-214AB, SMC]
J19  B06B-XASK-1-A  [conn6_2132415-6_TEC]
Q5  SQM110P06-8M9L_GE3  [SQM110P06_MOSFET]  (value not drawn)
Q6  SSM3K56FS,LF  [SSM_TOS]
Q2001  SSM3K56FS,LF  [SSM_TOS]
Q2002  SQM110P06-8M9L_GE3  [SQM110P06_MOSFET]  (value not drawn)
Q2003  SQM110P06-8M9L_GE3  [SQM110P06_MOSFET]  (value not drawn)
Q2004  SSM3K56FS,LF  [SSM_TOS]
R64  value 100K  [RES_0402_SMD]  (hidden comment: RMCF0402JT100K)
R65  value 100K  [RES_0402_SMD]  (hidden comment: RMCF0402JT100K)
R2001  value 100K  [RES_0402_SMD]  (hidden comment: RMCF0402JT100K)
R2002  value 100K  [RES_0402_SMD]  (hidden comment: RMCF0402JT100K)
R2003  value 100K  [RES_0402_SMD]  (hidden comment: RMCF0402JT100K)
R2004  value 100K  [RES_0402_SMD]  (hidden comment: RMCF0402JT100K)
R3001  value 0R  [RES_1206_SMD]  (hidden comment: *)

### Blocks framed on the sheet
ALARM1 CONTROL CIRCUIT: Q5 Q6 R64 R65
ALARM2 CONTROL CIRCUIT: Q2001 Q2002 R2001 R2002
ALARM3 CONTROL CIRCUIT: Q2003 Q2004 R2003 R2004
ALARM POWER INPUT: D21 R3001
ALARM POWER OUTPUT: J19

### Ports
ALRM1_PWOUT_CTRL, ALRM2_PWOUT_CTRL, ALRM3_PWOUT_CTRL

### Nets
12V0_PWIN: R3001.1
ALARM1_PWOUT: J19.1 Q5.3(D)
ALARM2_PWOUT: J19.3 Q2002.3(D)
ALARM3_PWOUT: J19.5 Q2003.3(D)
ALARM_PWIN: D21.2 Q5.2(S) Q2002.2(S) Q2003.2(S) R64.2 R2002.2 R2003.2 R3001.2
GND: D21.1 J19.2 J19.4 J19.6 Q6.2(S) Q2001.2(S) Q2004.2(S) R65.1 R2001.1 R2004.1
NetQ5_1: Q5.1(G) Q6.3(D) R64.1
NetQ6_1: Q6.1(G) R65.2 ; port ALRM1_PWOUT_CTRL
NetQ2001_1: Q2001.1(G) R2001.2 ; port ALRM2_PWOUT_CTRL
NetQ2001_3: Q2001.3(D) Q2002.1(G) R2002.1
NetQ2003_1: Q2003.1(G) Q2004.3(D) R2003.1
NetQ2004_1: Q2004.1(G) R2004.2 ; port ALRM3_PWOUT_CTRL

### Library data of the parts
D21 = SMLJ13CA: 21.5V Clamp 139.4A Ipp Tvs Diode Surface Mount SMC (DO-214AB); Tolerance: UD; Place: P; ComponentLink1Description: Digikey; ComponentLink1URL: https://www.digikey.com/en/products/detail/bourns-inc/SMLJ13CA/2253492; Package: DIONM7959X282N; Part Number: SMLJ13CA; Operating Temp.: UD
J19 = 2132415-6: as EXTRA1 on sheet MISC; TYPE: Header; RefDes: RefDes
Q5 Q2002 Q2003 = SQM110P06-8M9L_GE3: as Q1 on sheet POWER; Part Number: SQM110P06-8M9L_GE3; Value: N/A; Power: 110A; Tolerance: N/A; Package: SQM110P06-8M9L_GE3; Operating Temp.: -55°C ~ 150°C
Q6 Q2001 Q2004 = SSM3K56FS,LF: MOSFET (N-Channel); Manufacturer_Name: Toshiba; Datasheet Link: http://toshiba.semicon-storage.com/info/docget.jsp?did=13419&prodName=SSM3K56FS; Height: 0mm; Manufacturer_Part_Number: SSM3K56FS,LF; Mouser Part Number: 757-SSM3K56FSLF; Mouser Price/Stock: https://www.mouser.co.uk/ProductDetail/Toshiba/SSM3K56FSLF?qs=PiFplXvYe5XjAd54EjZm0w%3D%3D; Arrow Part Number: SSM3K56FS,LF; Arrow Price/Stock: https://www.arrow.com/en/products/ssm3k56fslf/toshiba?region=nac
R64 R65 R2001-R2004 = RES_GEN_SMD: Generic Chip Res; Place: P; Package: *; Part Number: RMCF0402JT100K; Power: *; Tolerance: *; Voltage: *; Operating Temp.: *
R3001 = RES_GEN_SMD: Generic Chip Res; Place: POP; Package: *; Part Number: *; Power: *; Tolerance: *; Voltage: *; Operating Temp.: *

## Sheet CONNECTORs.SchDoc
size A4
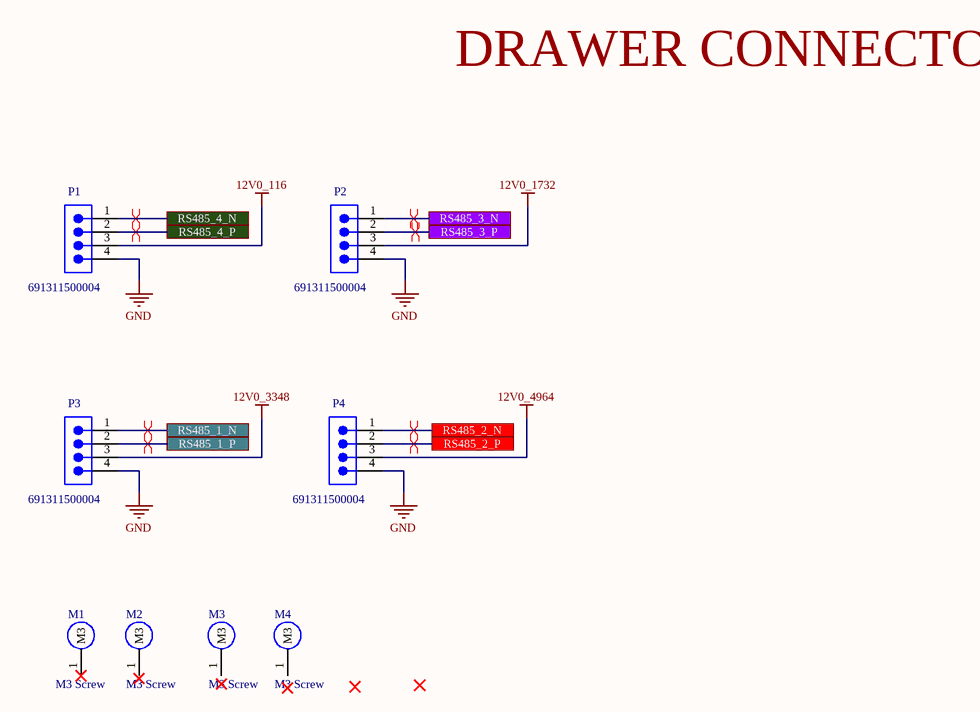
[diagram p6: CONNECTORs.SchDoc]

### Parts
M1  M3 Screw  [M3_Screw]
M2  M3 Screw  [M3_Screw]
M3  M3 Screw  [M3_Screw]
M4  M3 Screw  [M3_Screw]
P1  691311500004  [691311500004]
P2  691311500004  [691311500004]
P3  691311500004  [691311500004]
P4  691311500004  [691311500004]

### Ports
RS485_1_N, RS485_1_P, RS485_2_N, RS485_2_P, RS485_3_N, RS485_3_P, RS485_4_N, RS485_4_P

### Nets
12V0_116: P1.3
12V0_1732: P2.3
12V0_3348: P3.3
12V0_4964: P4.3
GND: P1.4 P2.4 P3.4 P4.4
RS485_1_N: P3.1 ; port RS485_1_N
RS485_1_P: P3.2 ; port RS485_1_P
RS485_2_N: P4.1 ; port RS485_2_N
RS485_2_P: P4.2 ; port RS485_2_P
RS485_3_N: P2.1 ; port RS485_3_N
RS485_3_P: P2.2 ; port RS485_3_P
RS485_4_N: P1.1 ; port RS485_4_N
RS485_4_P: P1.2 ; port RS485_4_P

Not connected (* = marked no-connect by the designer): M1 1(M3)*; M2 1(M3); M3 1(M3); M4 1(M3)

### Layout directives
differential pair: RS485_1_N, RS485_1_P, RS485_2_N, RS485_2_P, RS485_3_N, RS485_3_P, RS485_4_N, RS485_4_P

### Notes on the sheet
- DRAWER CONNECTORs

### Library data of the parts
M1 = M3 Screw: M3 Screw Hole; Place: POP
M2-M4 = M3 Screw: M3 Screw Hole; Place: DNP
P1-P4 = 691311500004: WR-TBL Series 311 Open Vertical PCB Header, THT, pitch 5.08mm, 04p; Manufacturer Part Number: SBDK 5,08-E2A/4; Manufacturer: Wurth Elektronik; Modularity: No; Rated Current: 20A; System: Pluggable Connector; Working Voltage: 300V; Category: Terminal Block; Match Code: WR-TBL; ComponentLink1Description: Website Link; ComponentLink1URL: https://www.we-online.com/redexpert/article/691311500004?ad; ComponentLink2Description: Datasheet Link; ComponentLink2URL: https://www.we-online.com/redexpert/spec/691311500004?ad; Mount: Through Hole; Min Operating Temperature: -40°C; Max Operating Temperature: 105°C; Packaging: Box; Application: Pluggable; Number of Pins: 4; Number of Rows: 1; Orientation: Vertical; Pitch: 5.08mm

## Nets that join several sheets
3V3_INT: POWER (5 pins), MICROCONTROLLER (L1.1), UART_USB (C27.1 R63.2 U11.1), MISC (16 pins)
5V0_INT: POWER (7 pins), UART_USB (D17.1), MISC (12 pins)
12V0_116: POWER (R48.2), CONNECTORs (P1.3)
12V0_1732: POWER (R1049.2), CONNECTORs (P2.3)
12V0_3348: POWER (R1050.2), CONNECTORs (P3.3)
12V0_4964: POWER (R1051.2), CONNECTORs (P4.3)
12V0_PWIN: POWER (P5.2 P5.3 Q1.3), ALARM_POWER (R3001.1)
GND: POWER (12 pins), MICROCONTROLLER (20 pins), UART_USB (11 pins), MISC (44 pins), ALARM_POWER (10 pins), CONNECTORs (P1.4 P2.4 P3.4 P4.4)
VDD_MCU: MICROCONTROLLER (18 pins), MISC (PROG1.1)
I2C_SCL-1: MICROCONTROLLER (U1.61), MISC (R7.1 U2.1 U3.6)
I2C_SDA-1: MICROCONTROLLER (U1.62), MISC (R6.1 U2.6 U3.5)
NetC3_2: MICROCONTROLLER (C3.2 R3.2 U1.7), MISC (PROG1.4)
NetEXTRA1_1: MICROCONTROLLER (U1.29), MISC (EXTRA1.1)
NetEXTRA1_2: MICROCONTROLLER (U1.30), MISC (EXTRA1.2)
NetEXTRA1_4: MICROCONTROLLER (U1.17), MISC (EXTRA1.4)
NetEXTRA1_5: MICROCONTROLLER (U1.16), MISC (EXTRA1.5)
NetPROG1_2: MICROCONTROLLER (U1.49), MISC (PROG1.2)
NetPROG1_3: MICROCONTROLLER (U1.46), MISC (PROG1.3)
NetQ6_1: MICROCONTROLLER (U1.56), ALARM_POWER (Q6.1 R65.2)
NetQ2001_1: MICROCONTROLLER (U1.27), ALARM_POWER (Q2001.1 R2001.2)
NetQ2004_1: MICROCONTROLLER (U1.26), ALARM_POWER (Q2004.1 R2004.2)
NetR8_1: MICROCONTROLLER (U1.50), MISC (R8.1 SW1.8)
NetR9_1: MICROCONTROLLER (U1.3), MISC (R9.1 SW1.7)
NetR10_1: MICROCONTROLLER (U1.8), MISC (R10.1 SW1.6)
NetR11_1: MICROCONTROLLER (U1.59), MISC (R11.1 SW1.5)
NetR12_1: MICROCONTROLLER (U1.58), MISC (R12.1 SW1.4)
NetR13_1: MICROCONTROLLER (U1.57), MISC (R13.1 SW1.3)
NetR14_1: MICROCONTROLLER (U1.4), MISC (R14.1 SW1.2)
NetR15_1: MICROCONTROLLER (U1.55), MISC (R15.1 SW1.1)
NetR23_2: MICROCONTROLLER (U1.15), MISC (R23.2)
NetR24_2: MICROCONTROLLER (U1.54), MISC (R24.2)
NetR27_2: MICROCONTROLLER (U1.14), MISC (R27.2)
NetR28_2: MICROCONTROLLER (U1.53), MISC (R28.2)
NetR31_2: MICROCONTROLLER (U1.33), MISC (R31.2 U4.2 U4.3)
NetR32_2: MICROCONTROLLER (U1.34), MISC (R32.2 U5.2 U5.3)
NetR33_2: MICROCONTROLLER (U1.22), MISC (R33.2)
NetR36_2: MICROCONTROLLER (U1.38), MISC (R36.2)
NetR37_2: MICROCONTROLLER (U1.52), MISC (R37.2)
NetR38_2: MICROCONTROLLER (U1.23), MISC (R38.2)
NetR41_2: MICROCONTROLLER (U1.37), MISC (R41.2)
NetR42_2: MICROCONTROLLER (U1.51), MISC (R42.2)
NetR45_2: MICROCONTROLLER (U1.35), MISC (R45.2 U6.2 U6.3)
NetR46_2: MICROCONTROLLER (U1.36), MISC (R46.2 U7.2 U7.3)
NetR47_2: MICROCONTROLLER (U1.21), MISC (R47.2)
NetR61_2: MICROCONTROLLER (U1.28), UART_USB (R61.2 R62.1)
NetU1_42: MICROCONTROLLER (U1.42), UART_USB (U11.2)
NetU1_43: MICROCONTROLLER (U1.43), UART_USB (U11.15)
RS485_1_N: MISC (D1.1 R22.1 R25.1 U4.7), CONNECTORs (P3.1)
RS485_1_P: MISC (D3.1 R25.2 R29.2 U4.6), CONNECTORs (P3.2)
RS485_2_N: MISC (D2.1 R21.1 R26.1 U5.7), CONNECTORs (P4.1)
RS485_2_P: MISC (D4.1 R26.2 R30.2 U5.6), CONNECTORs (P4.2)
RS485_3_N: MISC (D5.1 R34.1 R39.1 U6.7), CONNECTORs (P2.1)
RS485_3_P: MISC (D9.1 R39.2 R43.2 U6.6), CONNECTORs (P2.2)
RS485_4_N: MISC (D6.1 R35.1 R40.1 U7.7), CONNECTORs (P1.1)
RS485_4_P: MISC (D10.1 R40.2 R44.2 U7.6), CONNECTORs (P1.2)
USB_D_N: MICROCONTROLLER (R4.1), UART_USB (D19.2 J16.2 U11.7)
USB_D_P: MICROCONTROLLER (R5.1), UART_USB (D20.1 J16.3 U11.6)